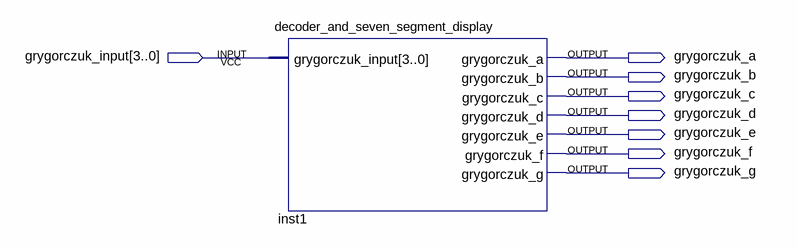
[diagram p0: schematic sheet]
// Quartus schematic SEVEN_SEGMENT_DISPLAY.bdf as structural Verilog: 1 symbols, 8 pins
module SEVEN_SEGMENT_DISPLAY (
  input  [3:0] grygorczuk_input,
  output grygorczuk_a,
  output grygorczuk_b,
  output grygorczuk_c,
  output grygorczuk_d,
  output grygorczuk_e,
  output grygorczuk_f,
  output grygorczuk_g
);

  decoder_and_seven_segment_display inst1 (
    .grygorczuk_input(grygorczuk_input), .grygorczuk_a(grygorczuk_a), .grygorczuk_b(grygorczuk_b),
    .grygorczuk_c(grygorczuk_c), .grygorczuk_d(grygorczuk_d), .grygorczuk_e(grygorczuk_e),
    .grygorczuk_f(grygorczuk_f), .grygorczuk_g(grygorczuk_g));
endmodule
